# EAGLE design killsw (EAGLE 8.4.3)
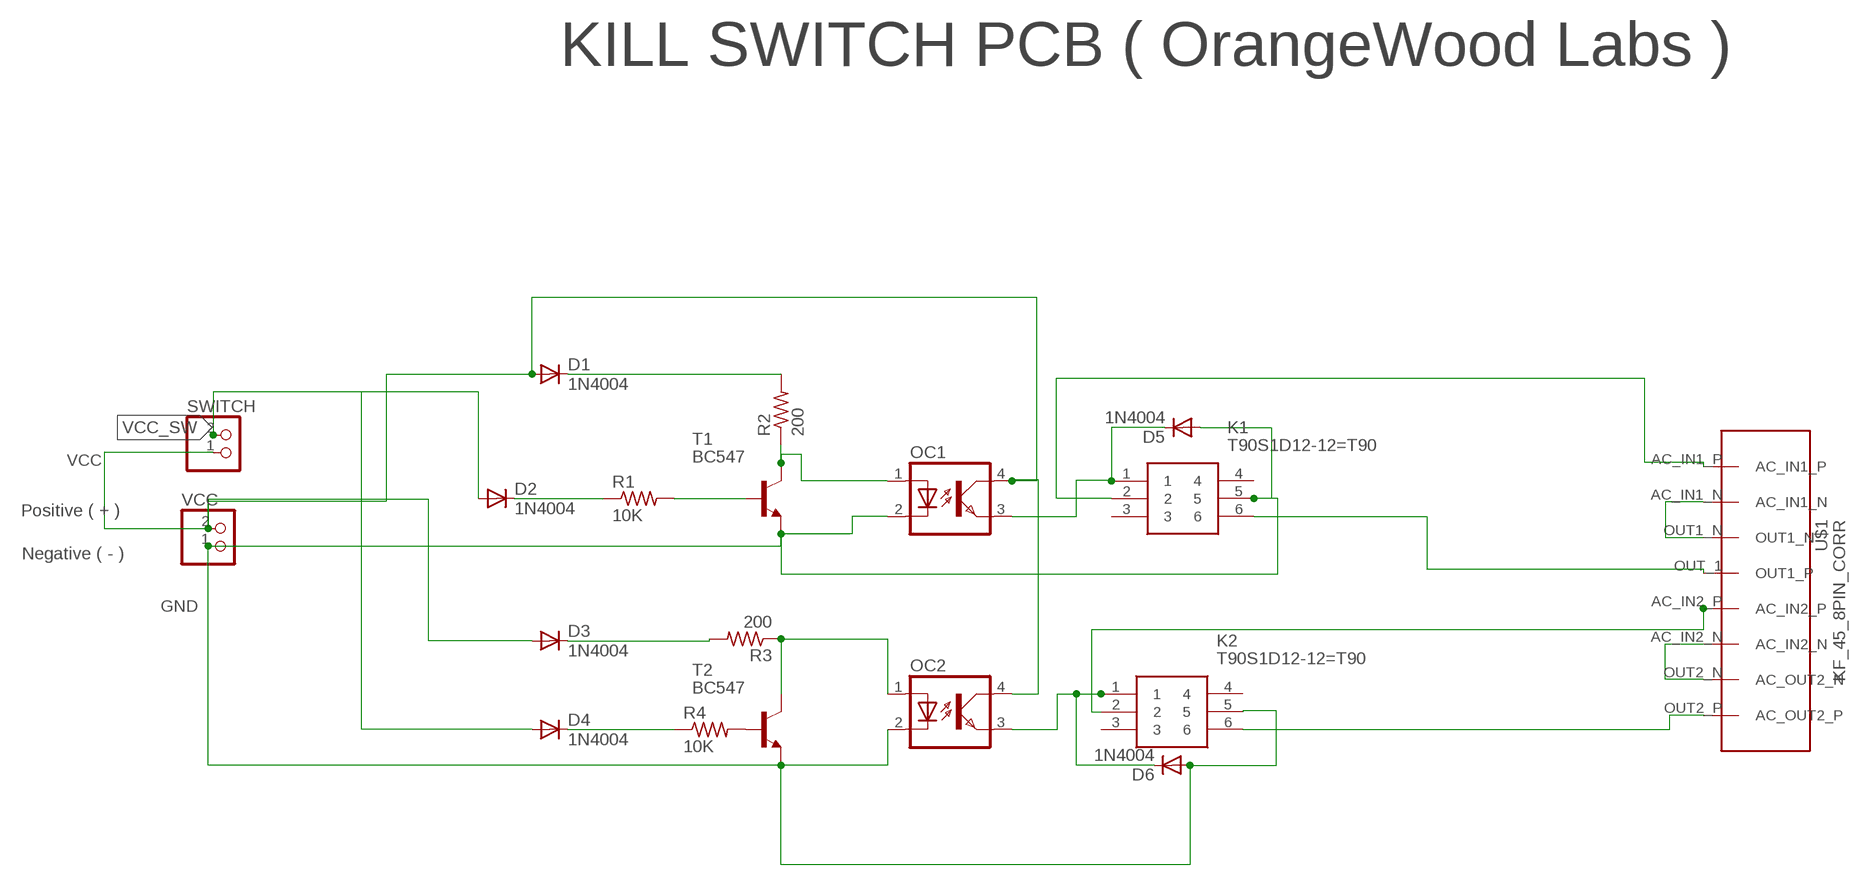
[diagram p0: schematic, sheet 1]

## Parts
D1  1N4004  [DO41-10]
D2  1N4004  [DO41-10]
D3  1N4004  [DO41-10]
D4  1N4004  [DO41-10]
D5  1N4004  [DO41-10]
D6  1N4004  [DO41-10]
K1  T90S1D12-12=T90  [T90S1D12-12=T90]
K2  T90S1D12-12=T90  [T90S1D12-12=T90]
OC1  PC817  [DIL04]
OC2  PC817  [DIL04]
R1  10K  R-US_0204/7  [0204/7]
R2  200  R-US_0204/7  [0204/7]
R3  200  R-US_0204/7  [0204/7]
R4  10K  R-US_0204/7  [0204/7]
SWITCH  JST_2PIN-THM  [JST-PH-2-THM]
T1  BC547  [TO92]
T2  BC547  [TO92]
U$1  KF_45_8PIN_CORR  [KF-45]
VCC  JST_2PIN-THM  [JST-PH-2-THM]

## Nets
GND: D5.A D6.A K1.5 K2.5 OC1.2(C) OC2.2(C) T1.1(E) T2.1(E) VCC.1
N$1: K1.2 U$1.AC_IN1_P
N$2: D1.C R2.2
N$3: D2.C R1.1
N$4: D3.C R3.2
N$5: OC1.1(A) R2.1 T1.3(C)
N$6: R1.2 T1.2(B)
N$7: K2.2 U$1.AC_IN2_P
N$9: R4.2 T2.2(B)
N$10: D5.C K1.1 OC1.3(EMIT)
N$11: K1.6 U$1.OUT_1(OUT1_P)
N$14: OC2.1(A) R3.1 T2.3(C)
N$15: D4.C R4.1
N$16: D6.C K2.1 OC2.3(EMIT)
N$17: K2.6 U$1.OUT2_P(AC_OUT2_P)
N$20: U$1.AC_IN1_N U$1.OUT1_N
N$21: U$1.AC_IN2_N U$1.OUT2_N(AC_OUT2_N)
VCC: D1.A D3.A OC1.4(COL) OC2.4(COL) SWITCH.1 VCC.2
VCC_SW: D2.A D4.A SWITCH.2
Unconnected: K1.3 K1.4 K2.3 K2.4

## Notes on the sheet
- KILL SWITCH PCB ( OrangeWood Labs )
- Positive ( + )
- Negative ( - )

## Library data of the parts
D1-D6 = diode:1N4004: DIODE general purpose rectifier, 1 A
K1 K2 = T90S1D12-12=T90:T90S1D12-12=T90: SPST-NO PCB Mount Non-Latching Relay Through Hole, 12V dc Source: Datasheet <http://uk.rs-online.com/web/p/products/6802565>; ARROW_PART_NUMBER: T90S1D12-12=T90; ARROW_PRICE/STOCK: http://uk.rs-online.com/web/p/products/1640200; DESCRIPTION: SPST-NO PCB Mount Non-Latching Relay Through Hole, 12V dc; HEIGHT: mm; MANUFACTURER_NAME: TE Connectivity; MANUFACTURER_PART_NUMBER: T90S1D12-12=T90; RS_PART_NUMBER: 1640200; RS_PRICE/STOCK: http://uk.rs-online.com/web/p/products/1640200
OC1 OC2 = optocoupler:PC817: SHARP OPTO COUPLER
R1-R4 = adafruit:R-US_: RESISTOR, American symbol
SWITCH VCC = adafruit:JST_2PIN: JST 2-Pin Connectors of various flavors SMT-RA (S2B-PH-SM4) 4UConnector #17311 SMT (B2B-PH-SM4) THM-RA (S2B-PH) THM (B2B-PH)
T1 T2 = transistor:BC547: NPN TRANSISTOR
U$1 = OrangeWood:KF_45_8PIN_CORR: KF Connector Pitch : 9.5 mm Diameter of Pin : 1.4 mm Above dimensions have been measured practically .

## Board
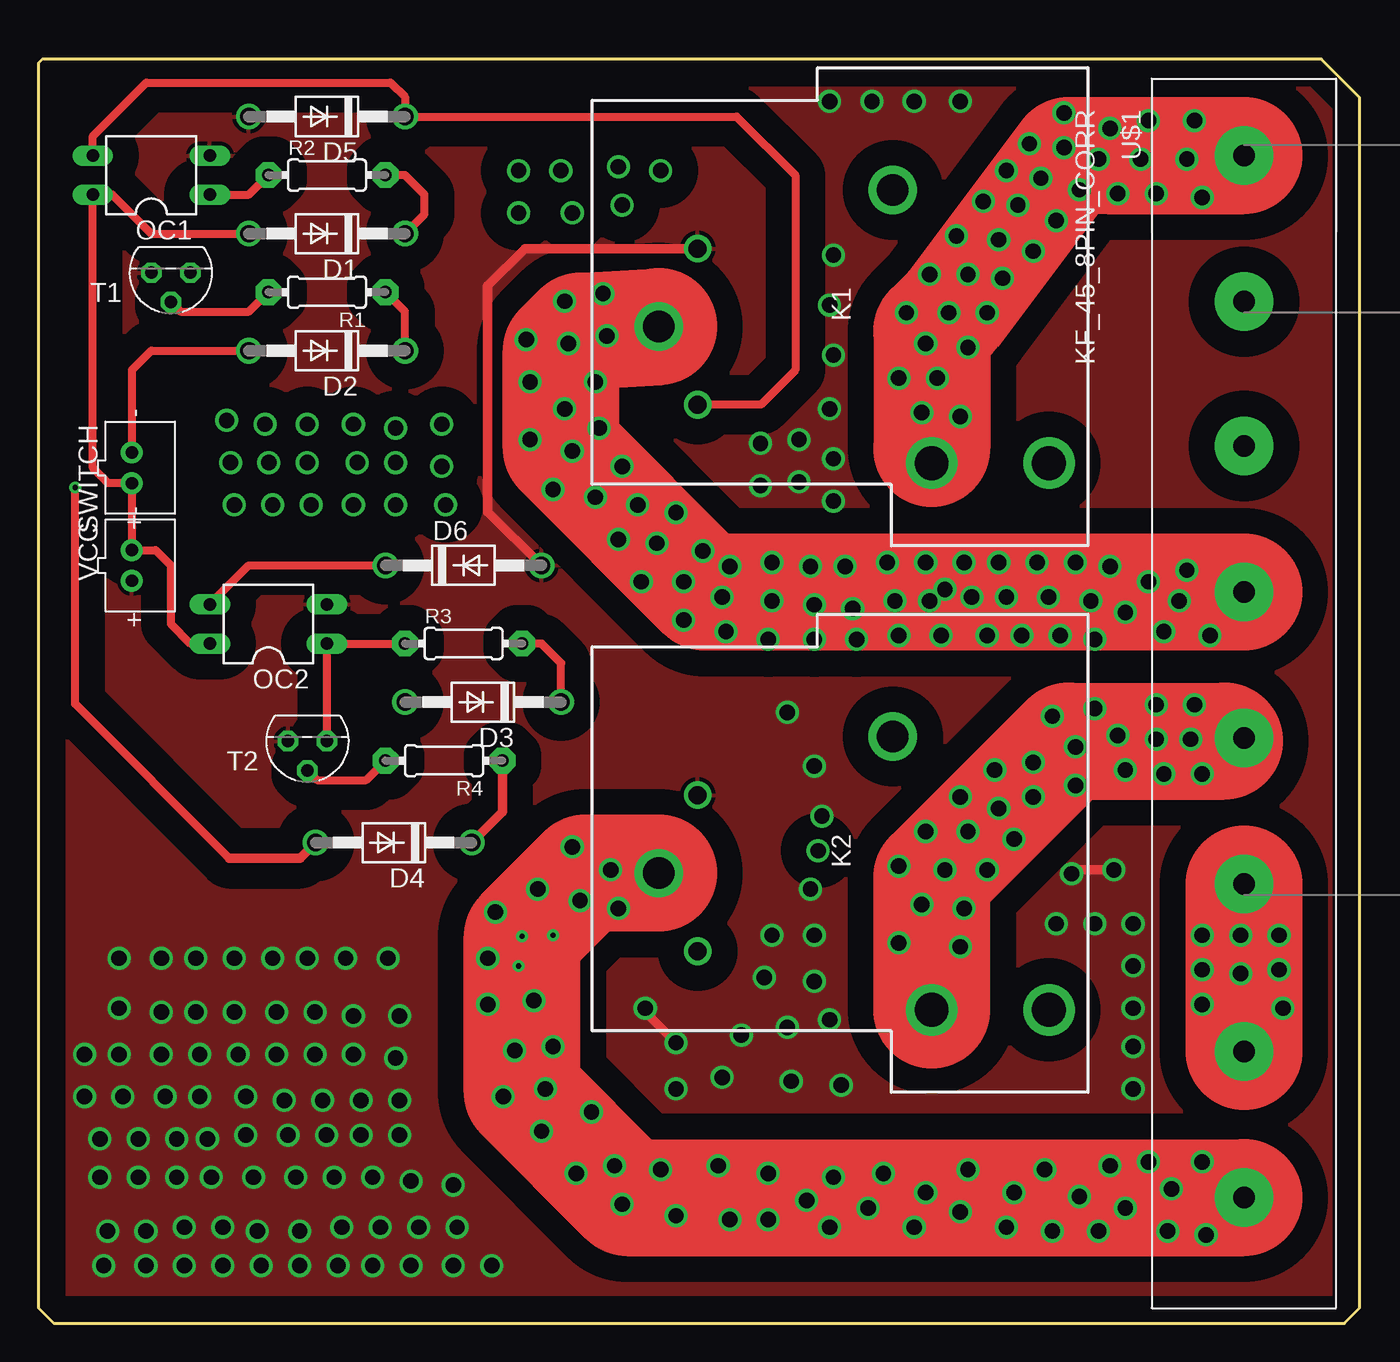
[diagram p1: board, top side]
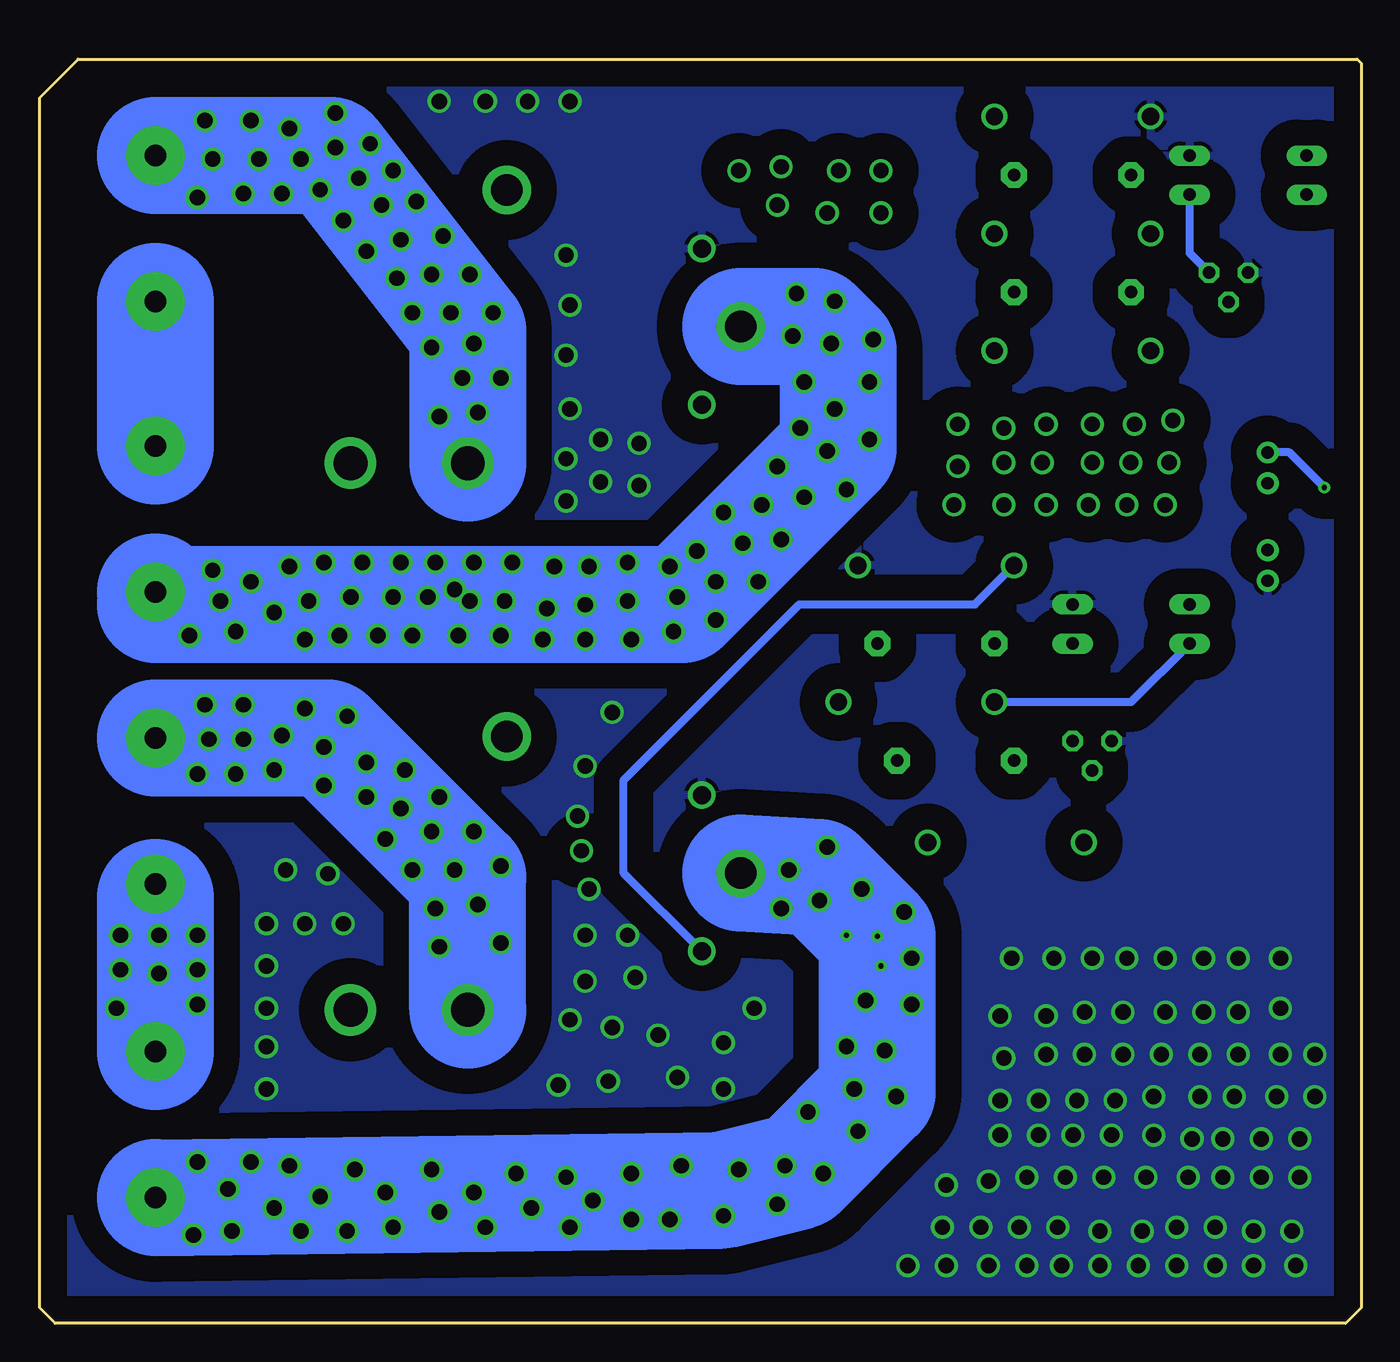
[diagram p2: board, bottom side, seen from below]

Size 86 x 82.25 mm. Coordinates in mm from the lower left corner, seen from the top.
Outline: 0,82 0,1 1,0 85,0 86,1 86,79.75 83.5,82.25 0.25,82.25 0,82
Copper layers (1*16): Top 0.035mm / dielectric 1.5mm / Bottom 0.035mm
Design rules "default": minimum track width 6mil, minimum drill 0.35mm, track to track 6mil, track to pad 6mil, pad to pad 6mil, via to via 6mil, smd to smd 6mil, copper to edge 40mil, drill to drill 6mil, minimum pad ring 10mil, minimum via ring 8mil, stop-mask expansion 4mil, vias tented up to drill 0mil, thermal gap 10mil

### Footprints (pad centres in the part's own frame; a part is rotated, then mirrored left to right if it is on the bottom)
DO41-10 = drill 1.118: A 5.08,0; C -5.08,0
T90S1D12-12=T90 = drill 1.17 pad 1.8: 1 -9.19,-25.4; 5 -19.35,-25.4 | drill 2.19 pad 3.35: 2 -5.38,-10.16; 3 -5.38,-2.54 | drill 2.06 pad 3.14: 4 -23.16,-12.7; 6 -14.27,-27.94
DIL04 = drill 0.813 long: 1 -1.27,-3.81; 2 1.27,-3.81; 3 1.27,3.81; 4 -1.27,3.81
0204/7 = drill 0.813 pad 1.676 octagon: 1 -3.81,0; 2 3.81,0
JST-PH-2-THM = drill 0.8 pad 1.422: 1 1,0; 2 -1,0
TO92 = drill 0.813 octagon: 1 1.27,0; 2 0,1.905; 3 -1.27,0
KF-45 = drill 1.4 pad 3.81: AC_IN1_N 9.5,0; AC_IN1_P 0,0; AC_IN2_N 47.4,0; AC_IN2_P 37.9,0; OUT1_N 18.9,0; OUT2_N 58.3,0; OUT2_P 67.8,0; OUT_1 28.4,0

### Placement (x,y rotation side)
D1  18.78,70.9 180 top
D2  18.78,63.28 180 top
D3  28.94,40.42 180 top
D4  23.13,31.28 180 top
D5  18.78,78.52 180 top
D6  27.67,49.31 0 top
K1  68.31,50.58 270 top
K2  68.31,15.02 270 top
OC1  7.35,74.71 90 top
OC2  14.97,45.5 90 top
R1  18.78,67.09 180 top
R2  18.78,74.71 0 top
R3  27.67,44.23 0 top
R4  26.4,36.61 180 top
SWITCH  6.08,55.66 270 top
T1  8.62,68.36 180 top
T2  17.51,37.88 180 top
U$1  78.47,75.98 270 top
VCC  6.08,49.31 270 top

### Tracks (layer width: path | path; a pad name or v marks a point on that pad's centre or on a via)
GND  (via drill 1)
  Top 0.61: D6.A 29.25,52.81 29.25,67.5 31.68,69.93 K1.5 | v41.5,18.25 39.5,20.25 v39.5,20.5 | v67.25,29.25 67.5,29.5 v70,29.5
  other vias: 14.5,3.75 12,3.75 9.5,3.75 7,3.75 19.5,3.75 4.25,3.75 21.75,3.75 24.25,3.75 17,3.75 27,3.75 29.5,3.75 4.5,6 7,6 9.5,6.25 27,9 27.25,6.25 24.75,6.25 22.25,6.25 19.75,6.25 17,6 14.25,6 12,6.25 5.25,23.75 8,23.75 10.25,23.75 12.75,23.75 15.25,23.75 17.5,23.75 20,23.75 22.75,23.75 5.25,20.5 8,20.25 10.25,20.25 12.75,20.25 15.5,20.25 18,20.25 20.5,20 23.5,20 24.25,9.25 21.75,9.5 19.25,9.5 16.75,9.5 14,9.5 11.25,9.5 9,9.5 6.5,9.5 4,9.5 23.5,12.25 21,12.25 23.25,17.25 23.5,14.5 21,14.5 18.5,14.5 16,14.5 13.5,14.75 10.5,14.75 8.25,14.75 5.5,14.75 3,14.75 18.75,12.25 16.25,12.25 13.5,12.25 11,12 9,12 6.5,12 4,12 3,17.5 5.25,17.5 8,17.5 10.5,17.5 13,17.5 15.5,17.5 18,17.5 20.5,17.5 60,79.5 57,79.5 54.25,79.5 51.5,79.5 51.75,69.5 51.5,66.25 51.75,63 51.5,59.5 51.75,53.5 51.75,56.25 49.5,57.5 47,57.25 47,54.5 49.5,54.75 50.5,36.25 48.75,39.75 51,33 50.25,28.25 50.5,25.25 47.75,25.25 47.25,22.5 50.5,22.25 48.75,19.25 51.5,19.75 52.25,15.5 49,15.75 45.75,18.75 44.5,16 41.5,15.25 71.25,15.25 71.25,18 71.25,20.5 71.25,23.25 71.25,26 68.75,26 66.25,26
  pour Top (isolate 1.676): -0.27,-6.57 97.52,-6.57 103.87,-0.22 103.87,82.33 100.06,86.14 1,86.14 -5.35,79.79 -5.35,-1.49
  pour Bottom (isolate 1.676): 3.54,-9.11 -10.43,4.86 -10.43,87.41 -6.62,91.22 103.87,91.22 111.49,83.6 111.49,-4.03 106.41,-9.11
N$1
  Top 7.62: 69.58,75.98 U$1.AC_IN1_P 67.04,75.98 59.42,65.82 58.15,64.55 58.15,56.93
  Bottom 7.62: K1.2 58.15,64.55 67.04,75.98 U$1.AC_IN1_P
N$2
  Top 0.508: D1.C 25.13,72.17 25.13,73.44 23.86,74.71 R2.2
N$3
  Top 0.508: D2.C 23.86,65.82 R1.1
N$4
  Top 0.508: D3.C 34.02,42.96 32.75,44.23 R3.2
N$5
  Top 0.508: OC1.1 13.7,73.44 R2.1
  Bottom 0.508: T1.3 11.16,69.63 OC1.1
N$6
  Top 0.508: T1.2 9.26,65.82 13.7,65.82 R1.2
N$7
  Top 7.62: K2.2 58.15,28.99 67.04,37.88 77.2,37.88
  Bottom 7.62: K2.2 58.15,28.99 67.24,38.08 U$1.AC_IN2_P
N$8  (via drill 0.35)
  other vias: 33.5,25.25
N$9
  Top 0.508: T2.2 18.14,35.34 21.32,35.34 R4.2
N$10
  Top 0.508: K1.1 47.02,59.77 49.26,62.01 49.26,74.71 45.45,78.52 D5.C 23.86,79.79 22.92,80.73 7.02,80.73 3.54,77.25 OC1.3
N$11
  Top 7.62: U$1.OUT_1 43.37,47.58 34.02,56.93 34.02,63.28 35.29,64.55 K1.6
  Bottom 7.62: U$1.OUT_1 78.47,46.77 44.18,46.77 34.02,56.93 34.02,63.28 35.59,64.85 K1.6
N$12  (via drill 0.35)
  other vias: 31.25,23.25
N$13  (via drill 1)
  other vias: 32.25,21
N$14
  Top 0.508: R3.1 OC2.1 T2.3
N$15
  Top 0.61: D4.C 30.21,33.28 R4.1
N$16
  Top 0.508: OC2.3 13.7,49.31 D6.C
  Bottom 0.508: K2.1 47.99,29.29 47.99,35.34 36.56,46.77 25.13,46.77 D6.C
N$17  (via drill 0.35)
  Top 7.62: U$1.OUT2_P 38.32,8.18 31.48,15.02 v31.48,25.18 35.59,29.29 K2.6
  Bottom 7.62: U$1.OUT2_P 41.64,8.67 36.56,9.94 31.48,15.02 v31.48,25.18 35.29,28.99 K2.6
N$18  (via drill 1)
  other vias: 31,17.75
N$19  (via drill 1)
  other vias: 32.75,12.5
N$20
  Bottom 7.62: U$1.OUT1_N U$1.AC_IN1_N
N$21
  Top 7.62: U$1.AC_IN2_N U$1.OUT2_N
  Bottom 7.62: U$1.OUT2_N 78.47,27.72
N$22  (via drill 1)
  other vias: 38,7.75
N$23  (via drill 1)
  other vias: 40.5,10
N$24  (via drill 1)
  other vias: 37.5,10.25
N$25  (via drill 1)
  other vias: 35,9.75
N$26  (via drill 1)
  other vias: 36,13.75
N$27  (via drill 1)
  other vias: 33,15.25
N$28  (via drill 1)
  other vias: 30.25,14.75
N$29  (via drill 1)
  other vias: 29.25,20.75
N$30  (via drill 1)
  other vias: 32.5,28.25
N$31  (via drill 1)
  other vias: 35.25,27.5
N$32  (via drill 1)
  other vias: 34.75,31
N$33  (via drill 1)
  other vias: 37.75,27
N$34  (via drill 1)
  other vias: 37.25,29.5
N$35  (via drill 1)
  other vias: 29.75,26.75
N$36  (via drill 1)
  other vias: 29.25,23.75
N$37  (via drill 1)
  other vias: 44.25,10.25
N$38  (via drill 1)
  other vias: 41.5,7
N$39  (via drill 1)
  other vias: 45,6.75
N$40  (via drill 1)
  other vias: 47.5,9.75
N$41  (via drill 1)
  other vias: 47.5,6.75
N$42  (via drill 1)
  other vias: 51.5,6.25
N$43  (via drill 1)
  other vias: 51.75,9.5
N$44  (via drill 1)
  other vias: 50,8
N$45  (via drill 1)
  other vias: 55,9.75
N$46  (via drill 1)
  other vias: 54,7.5
N$47  (via drill 1)
  other vias: 57,6.25
N$48  (via drill 1)
  other vias: 57.75,8.5
N$49  (via drill 1)
  other vias: 60.5,10
N$50  (via drill 1)
  other vias: 60,7.25
N$51  (via drill 1)
  other vias: 63,6.25
N$52  (via drill 1)
  other vias: 63.5,8.5
N$53  (via drill 1)
  other vias: 65.5,10
N$54  (via drill 1)
  other vias: 66,6
N$55  (via drill 1)
  other vias: 67.75,8.25
N$56  (via drill 1)
  other vias: 69.75,10.25
N$57  (via drill 1)
  other vias: 70.75,7.5
N$58  (via drill 1)
  other vias: 69,6
N$59  (via drill 1)
  other vias: 73.5,6
N$60  (via drill 1)
  other vias: 73.75,8.75
N$61  (via drill 1)
  other vias: 72.25,10.5
N$62  (via drill 1)
  other vias: 75.75,10.5
N$63  (via drill 1)
  other vias: 76,5.75
N$64  (via drill 1)
  other vias: 33.5,18
N$65  (via drill 1)
  other vias: 75.75,35.75
N$66  (via drill 1)
  other vias: 75,38
N$67  (via drill 1)
  other vias: 75.25,40.25
N$68  (via drill 1)
  other vias: 72.75,40.25
N$69  (via drill 1)
  other vias: 72.75,38
N$70  (via drill 1)
  other vias: 73.25,35.75
N$71  (via drill 1)
  other vias: 70.75,36
N$72  (via drill 1)
  other vias: 70.25,38.25
N$73  (via drill 1)
  other vias: 68.75,40
N$74  (via drill 1)
  other vias: 66,39.5
N$75  (via drill 1)
  other vias: 67.5,37.5
N$76  (via drill 1)
  other vias: 67.5,35
N$77  (via drill 1)
  other vias: 64.75,34.25
N$78  (via drill 1)
  other vias: 64.75,36.5
N$79  (via drill 1)
  other vias: 62.25,36
N$80  (via drill 1)
  other vias: 62.5,33.5
N$81  (via drill 1)
  other vias: 63.5,31.5
N$82  (via drill 1)
  other vias: 60,34.25
N$83  (via drill 1)
  other vias: 60.5,32
N$84  (via drill 1)
  other vias: 61.75,29.5
N$85  (via drill 1)
  other vias: 57.75,32
N$86  (via drill 1)
  other vias: 59,29.5
N$87  (via drill 1)
  other vias: 60.25,27
N$88  (via drill 1)
  other vias: 56,29.75
N$89  (via drill 1)
  other vias: 57.5,27.25
N$90  (via drill 1)
  other vias: 60,24.5
N$91  (via drill 1)
  other vias: 56,24.75
N$92  (via drill 1)
  other vias: 60,59
N$93  (via drill 1)
  other vias: 57.5,59.25
N$94  (via drill 1)
  other vias: 56,61.5
N$95  (via drill 1)
  other vias: 58.5,61.5
N$96  (via drill 1)
  other vias: 60.5,63.5
N$97  (via drill 1)
  other vias: 57.75,63.75
N$98  (via drill 1)
  other vias: 56.5,65.75
N$99  (via drill 1)
  other vias: 59.25,65.75
N$100  (via drill 1)
  other vias: 61.75,65.75
N$101  (via drill 1)
  other vias: 62.75,68
N$102  (via drill 1)
  other vias: 58,68.25
N$103  (via drill 1)
  other vias: 60.5,68.25
N$104  (via drill 1)
  other vias: 64.75,69.75
N$105  (via drill 1)
  other vias: 62.5,70.5
N$106  (via drill 1)
  other vias: 59.75,70.75
N$107  (via drill 1)
  other vias: 61.5,73
N$108  (via drill 1)
  other vias: 63.75,72.75
N$109  (via drill 1)
  other vias: 66.25,71.75
N$110  (via drill 1)
  other vias: 68.75,44.5
N$111  (via drill 1)
  other vias: 66.5,44.75
N$112  (via drill 1)
  other vias: 70.75,46.25
N$113  (via drill 1)
  other vias: 68.5,47
N$114  (via drill 1)
  other vias: 65.75,47.25
N$115  (via drill 1)
  other vias: 67.5,49.5
N$116  (via drill 1)
  other vias: 69.75,49.25
N$117  (via drill 1)
  other vias: 72.25,48.25
N$118  (via drill 1)
  other vias: 65,49.5
N$119  (via drill 1)
  other vias: 62.5,49.5
N$120  (via drill 1)
  other vias: 63,47.25
N$121  (via drill 1)
  other vias: 64,44.75
N$122  (via drill 1)
  other vias: 61.75,44.75
N$123  (via drill 1)
  other vias: 60.75,47.25
N$124  (via drill 1)
  other vias: 60.25,49.5
N$125  (via drill 1)
  other vias: 57.75,49.5
N$126  (via drill 1)
  other vias: 58,47
N$127  (via drill 1)
  other vias: 58.75,44.75
N$128  (via drill 1)
  other vias: 56,44.75
N$129  (via drill 1)
  other vias: 55.75,47
N$130  (via drill 1)
  other vias: 55.25,49.5
N$131  (via drill 1)
  other vias: 52.5,49.25
N$132  (via drill 1)
  other vias: 53,46.5
N$133  (via drill 1)
  other vias: 53.25,44.5
N$134  (via drill 1)
  other vias: 50.5,44.5
N$135  (via drill 1)
  other vias: 50.5,46.75
N$136  (via drill 1)
  other vias: 50.25,49.25
N$137  (via drill 1)
  other vias: 47.75,49.5
N$138  (via drill 1)
  other vias: 47.75,47
N$139  (via drill 1)
  other vias: 47.5,44.5
N$140  (via drill 1)
  other vias: 44.75,45
N$141  (via drill 1)
  other vias: 44.5,47.25
N$142  (via drill 1)
  other vias: 45,49.25
N$143  (via drill 1)
  other vias: 43.25,50.25
N$144  (via drill 1)
  other vias: 42,48.25
N$145  (via drill 1)
  other vias: 42,45.75
N$146  (via drill 1)
  other vias: 39.25,48.25
N$147  (via drill 1)
  other vias: 40.25,50.75
N$148  (via drill 1)
  other vias: 41.5,52.75
N$149  (via drill 1)
  other vias: 36.75,67
N$150  (via drill 1)
  other vias: 37,64.25
N$151  (via drill 1)
  other vias: 34.25,66.5
N$152  (via drill 1)
  other vias: 34.5,63.75
N$153  (via drill 1)
  other vias: 36.25,61.25
N$154  (via drill 1)
  other vias: 31.75,64
N$155  (via drill 1)
  other vias: 32,61.25
N$156  (via drill 1)
  other vias: 34.25,59.5
N$157  (via drill 1)
  other vias: 36.5,58.25
N$158  (via drill 1)
  other vias: 32,57.5
N$159  (via drill 1)
  other vias: 34.75,56.75
N$160  (via drill 1)
  other vias: 38,55.75
N$161  (via drill 1)
  other vias: 33.5,54.25
N$162  (via drill 1)
  other vias: 36.25,53.75
N$163  (via drill 1)
  other vias: 39,53.25
N$164  (via drill 1)
  other vias: 37.75,51
N$165  (via drill 1)
  other vias: 73.25,45
N$166  (via drill 1)
  other vias: 74.25,47
N$167  (via drill 1)
  other vias: 74.75,49
N$168  (via drill 1)
  other vias: 76.25,44.75
N$169  (via drill 1)
  other vias: 63,75
N$170  (via drill 1)
  other vias: 65.25,74.5
N$171  (via drill 1)
  other vias: 67.75,73.75
N$172  (via drill 1)
  other vias: 64.5,76.75
N$173  (via drill 1)
  other vias: 66.75,78.75
N$174  (via drill 1)
  other vias: 66.75,76.5
N$175  (via drill 1)
  other vias: 69,75.75
N$176  (via drill 1)
  other vias: 70.25,73.5
N$177  (via drill 1)
  other vias: 72.75,73.5
N$178  (via drill 1)
  other vias: 75.75,73.25
N$179  (via drill 1)
  other vias: 74.75,75.75
N$180  (via drill 1)
  other vias: 71.75,75.75
N$181  (via drill 1)
  other vias: 69.75,77.75
N$182  (via drill 1)
  other vias: 72.25,78.25
N$183  (via drill 1)
  other vias: 75.25,78.25
N$184  (via drill 1)
  other vias: 75.75,25.25
N$185  (via drill 1)
  other vias: 78.25,25.25
N$186  (via drill 1)
  other vias: 80.75,25.25
N$187  (via drill 1)
  other vias: 75.75,23
N$188  (via drill 1)
  other vias: 78.25,22.75
N$189  (via drill 1)
  other vias: 80.75,23
N$190  (via drill 1)
  other vias: 75.75,20.75
N$191  (via drill 1)
  other vias: 81,20.5
N$283  (via drill 1)
  other vias: 50.75,30.75
N$287  (via drill 1)
  other vias: 12.75,53.25
N$288  (via drill 1)
  other vias: 15.25,53.25
N$289  (via drill 1)
  other vias: 17.75,53.25
N$290  (via drill 1)
  other vias: 20.5,53.25
N$291  (via drill 1)
  other vias: 12.5,56
N$292  (via drill 1)
  other vias: 15,56
N$293  (via drill 1)
  other vias: 17.5,56
N$294  (via drill 1)
  other vias: 20.75,56
N$295  (via drill 1)
  other vias: 12.25,58.75
N$296  (via drill 1)
  other vias: 14.75,58.5
N$297  (via drill 1)
  other vias: 17.5,58.5
N$298  (via drill 1)
  other vias: 20.5,58.5
N$299  (via drill 1)
  other vias: 23.25,58.25
N$300  (via drill 1)
  other vias: 23.25,56
N$301  (via drill 1)
  other vias: 23.25,53.25
N$302  (via drill 1)
  other vias: 26.5,53.25
N$303  (via drill 1)
  other vias: 26.25,55.75
N$304  (via drill 1)
  other vias: 26.25,58.5
N$305  (via drill 1)
  other vias: 31.25,75
N$306  (via drill 1)
  other vias: 34,75
N$307  (via drill 1)
  other vias: 37.75,75.25
N$308  (via drill 1)
  other vias: 40.5,75
N$309  (via drill 1)
  other vias: 31.25,72.25
N$310  (via drill 1)
  other vias: 34.75,72.25
N$311  (via drill 1)
  other vias: 38,72.75
N$335  (via drill 1)
  other vias: 59,47.75
VCC
  Top 0.508: D1.A 7.35,70.9 4.81,73.44 OC1.4 3.54,55.66 4.54,54.66 SWITCH.1 VCC.2 7.62,50.31 8.62,49.31 8.62,45.5 9.89,44.23 OC2.4
  Bottom 0.508: OC2.4 14.97,40.42 D3.A
VCC_SW  (via drill 0.35)
  Top 0.508: SWITCH.2 6.08,62.01 7.35,63.28 D2.A | 12.43,30.26 2.39,40.3 v2.39,54.39
  Top 0.61: 12.43,30.26 17.03,30.26 D4.A
  Bottom 0.508: v2.39,54.39 4.66,56.66 SWITCH.2